# Altium project pca10156.PrjPCB (part 4 of 4)
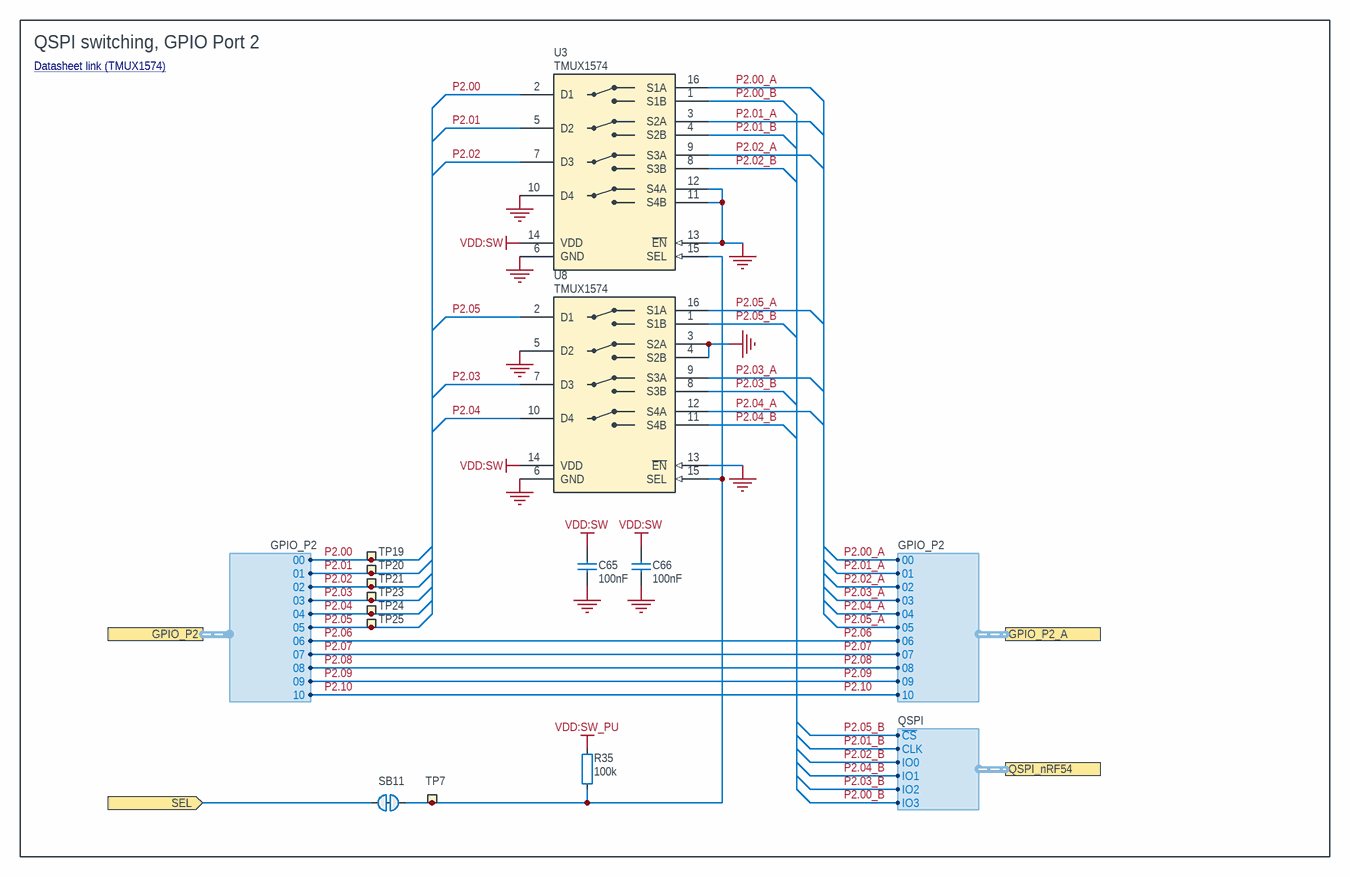
[diagram p8: pca10156_sheet8_switches.SchDoc]

## Nets that join several sheets
GND: pca10156_sheet2_nRF54L15 (23 pins), pca10156_sheet3_debugger (33 pins), pca10156_sheet4_level_shifters (22 pins), pca10156_sheet5_misc (19 pins), pca10156_sheet6_power_supply (26 pins), pca10156_sheet7_connectors (43 pins), pca10156_sheet8_switches (12 pins)
P5V0: pca10156_sheet3_debugger (R40.2), pca10156_sheet6_power_supply (13 pins), pca10156_sheet7_connectors (6 pins)
VBUS: pca10156_sheet3_debugger (J4.5 R5.2), pca10156_sheet6_power_supply (C23.2 TP8.1 U10.21), pca10156_sheet7_connectors (C54.1 R36.2 SW4.4)
VDD:DBGR: pca10156_sheet3_debugger (29 pins), pca10156_sheet4_level_shifters (10 pins), pca10156_sheet6_power_supply (C29.1 U10.12)
VDD:IO: pca10156_sheet3_debugger (R41.2), pca10156_sheet4_level_shifters (7 pins), pca10156_sheet5_misc (SB9.1), pca10156_sheet6_power_supply (R9.2 R37.2 TP11.1), pca10156_sheet7_connectors (12 pins)
VDD:nRF: pca10156_sheet2_nRF54L15 (12 pins), pca10156_sheet4_level_shifters (R28.1), pca10156_sheet5_misc (R23.2 SB10.1), pca10156_sheet6_power_supply (P6.2 R24.1 R43.1)
VDD:SW: pca10156_sheet4_level_shifters (10 pins), pca10156_sheet8_switches (C65.1 C66.1 U3.14 U8.14)
VDD:SW_PU: pca10156_sheet4_level_shifters (8 pins), pca10156_sheet8_switches (R35.2)
VDD:SWD0: pca10156_sheet4_level_shifters (C14.1 R18.2 U7.11), pca10156_sheet7_connectors (C73.2 P5.3 P19.1)
DBGR_BUTTON: pca10156_sheet1_connections (SB2.2), pca10156_sheet3_debugger (U2.AL27)
DBGR_N: pca10156_sheet3_debugger (U2.B4), pca10156_sheet7_connectors (U11.7)
DBGR_P: pca10156_sheet3_debugger (U2.B2), pca10156_sheet7_connectors (U11.6)
LED_PWR_CTRL: pca10156_sheet3_debugger (U2.A17), pca10156_sheet6_power_supply (U10.8)
NetC64_2: pca10156_sheet5_misc (5 pins), pca10156_sheet6_power_supply (U10.31)
NetJ3_A5: pca10156_sheet6_power_supply (U10.23), pca10156_sheet7_connectors (J3.A5)
NetJ3_B5: pca10156_sheet6_power_supply (U10.24), pca10156_sheet7_connectors (J3.B5)
NetP1_5: pca10156_sheet2_nRF54L15 (R33.2), pca10156_sheet7_connectors (P1.5)
NetP1_6: pca10156_sheet2_nRF54L15 (R34.2), pca10156_sheet7_connectors (P1.6)
NetSB1_2: pca10156_sheet1_connections (SB1.2 SB2.1), pca10156_sheet5_misc (SB8.1 SW1.2)
NFC1: pca10156_sheet5_misc (C17.1 R21.2), pca10156_sheet7_connectors (J7.2)
NFC2: pca10156_sheet5_misc (C19.2 R22.2), pca10156_sheet7_connectors (J7.4)
nRF54_RESET: pca10156_sheet1_connections (SB1.1), pca10156_sheet2_nRF54L15 (P3.1 R3.2), pca10156_sheet4_level_shifters (U6.9), pca10156_sheet7_connectors (P15.10 P16.10)
P0.00: pca10156_sheet2_nRF54L15 (U1.23), pca10156_sheet4_level_shifters (U4.6), pca10156_sheet7_connectors (P0.3)
P0.01: pca10156_sheet2_nRF54L15 (U1.24), pca10156_sheet4_level_shifters (U4.3), pca10156_sheet7_connectors (P0.4)
P0.02: pca10156_sheet2_nRF54L15 (U1.27), pca10156_sheet4_level_shifters (U4.13), pca10156_sheet7_connectors (P0.5)
P0.03: pca10156_sheet2_nRF54L15 (U1.28), pca10156_sheet4_level_shifters (U4.9), pca10156_sheet7_connectors (P0.6)
P0.04: pca10156_sheet2_nRF54L15 (U1.29), pca10156_sheet5_misc (SW6.2), pca10156_sheet7_connectors (P0.7)
P1.00: pca10156_sheet2_nRF54L15 (SB5.2), pca10156_sheet7_connectors (P1.3)
P1.01: pca10156_sheet2_nRF54L15 (SB6.2), pca10156_sheet7_connectors (P1.4)
P1.02/NFC1: pca10156_sheet2_nRF54L15 (R33.1 U1.3), pca10156_sheet5_misc (R21.1)
P1.03/NFC2: pca10156_sheet2_nRF54L15 (R34.1 U1.4), pca10156_sheet5_misc (R22.1)
P1.04: pca10156_sheet2_nRF54L15 (U1.5), pca10156_sheet4_level_shifters (U5.6), pca10156_sheet7_connectors (P1.7)
P1.05: pca10156_sheet2_nRF54L15 (U1.6), pca10156_sheet4_level_shifters (U5.3), pca10156_sheet7_connectors (P1.8)
P1.06: pca10156_sheet2_nRF54L15 (U1.7), pca10156_sheet4_level_shifters (U5.13), pca10156_sheet7_connectors (P1.9)
P1.07: pca10156_sheet2_nRF54L15 (U1.8), pca10156_sheet4_level_shifters (U5.9), pca10156_sheet7_connectors (P1.10)
P1.08: pca10156_sheet2_nRF54L15 (C41.2 U1.9), pca10156_sheet5_misc (SW5.2), pca10156_sheet7_connectors (P1.11)
P1.09: pca10156_sheet2_nRF54L15 (U1.37), pca10156_sheet5_misc (SW3.2), pca10156_sheet7_connectors (P1.12)
P1.10: pca10156_sheet2_nRF54L15 (U1.38), pca10156_sheet5_misc (Q3.2 R11.1), pca10156_sheet7_connectors (P1.13)
P1.11: pca10156_sheet2_nRF54L15 (U1.39), pca10156_sheet7_connectors (P1.14)
P1.12: pca10156_sheet2_nRF54L15 (U1.40), pca10156_sheet7_connectors (P1.15)
P1.13: pca10156_sheet2_nRF54L15 (U1.41), pca10156_sheet5_misc (SW2.2), pca10156_sheet7_connectors (P1.16)
P1.14: pca10156_sheet2_nRF54L15 (U1.42), pca10156_sheet5_misc (Q3.5 R27.1), pca10156_sheet7_connectors (P1.17)
P2.00: pca10156_sheet2_nRF54L15 (U1.11), pca10156_sheet8_switches (TP19.1 U3.2)
P2.00_A: pca10156_sheet7_connectors (P2.3), pca10156_sheet8_switches (U3.16)
P2.00_B: pca10156_sheet5_misc (U9.7), pca10156_sheet8_switches (U3.1)
P2.01: pca10156_sheet2_nRF54L15 (U1.12), pca10156_sheet8_switches (TP20.1 U3.5)
P2.01_A: pca10156_sheet7_connectors (P2.4), pca10156_sheet8_switches (U3.3)
P2.01_B: pca10156_sheet5_misc (U9.6), pca10156_sheet8_switches (U3.4)
P2.02: pca10156_sheet2_nRF54L15 (U1.13), pca10156_sheet8_switches (TP21.1 U3.7)
P2.02_A: pca10156_sheet7_connectors (P2.5), pca10156_sheet8_switches (U3.9)
P2.02_B: pca10156_sheet5_misc (U9.5), pca10156_sheet8_switches (U3.8)
P2.03: pca10156_sheet2_nRF54L15 (U1.14), pca10156_sheet8_switches (TP23.1 U8.7)
P2.03_A: pca10156_sheet7_connectors (P2.6), pca10156_sheet8_switches (U8.9)
P2.03_B: pca10156_sheet5_misc (U9.3), pca10156_sheet8_switches (U8.8)
P2.04: pca10156_sheet2_nRF54L15 (U1.15), pca10156_sheet8_switches (TP24.1 U8.10)
P2.04_A: pca10156_sheet7_connectors (P2.7), pca10156_sheet8_switches (U8.12)
P2.04_B: pca10156_sheet5_misc (U9.2), pca10156_sheet8_switches (U8.11)
P2.05: pca10156_sheet2_nRF54L15 (U1.16), pca10156_sheet8_switches (TP25.1 U8.2)
P2.05_A: pca10156_sheet7_connectors (P2.8), pca10156_sheet8_switches (U8.16)
P2.05_B: pca10156_sheet5_misc (R39.1 U9.1), pca10156_sheet8_switches (U8.1)
P2.06: pca10156_sheet2_nRF54L15 (U1.17), pca10156_sheet7_connectors (P2.9 P16.12)
P2.07: pca10156_sheet2_nRF54L15 (U1.18), pca10156_sheet4_level_shifters (U6.13), pca10156_sheet5_misc (Q2.5 R12.1), pca10156_sheet7_connectors (P2.10 P15.6 P16.6 P16.14)
P2.08: pca10156_sheet2_nRF54L15 (U1.19), pca10156_sheet7_connectors (P2.11 P16.16)
P2.09: pca10156_sheet2_nRF54L15 (U1.20), pca10156_sheet5_misc (Q2.2 R10.1), pca10156_sheet7_connectors (P2.12 P16.18)
P2.10: pca10156_sheet2_nRF54L15 (U1.21), pca10156_sheet7_connectors (P2.13 P16.20)
QSPI_CTRL: pca10156_sheet3_debugger (U2.B14), pca10156_sheet8_switches (SB11.1)
SWD0_CLK: pca10156_sheet3_debugger (U2.B18), pca10156_sheet4_level_shifters (U7.4)
SWD0_CLK_EXT: pca10156_sheet4_level_shifters (U7.8), pca10156_sheet7_connectors (P19.4)
SWD0_IO: pca10156_sheet3_debugger (U2.B16), pca10156_sheet4_level_shifters (U7.5)
SWD0_IO_EXT: pca10156_sheet4_level_shifters (U7.7), pca10156_sheet7_connectors (P19.2)
SWD0_RESET: pca10156_sheet3_debugger (U2.B22), pca10156_sheet4_level_shifters (U7.2)
SWD0_RESET_EXT: pca10156_sheet4_level_shifters (U7.10), pca10156_sheet7_connectors (P19.10)
SWD0_SEL: pca10156_sheet3_debugger (U2.B24), pca10156_sheet4_level_shifters (Q1.5), pca10156_sheet7_connectors (P19.3)
SWD0_SWO: pca10156_sheet3_debugger (U2.B20), pca10156_sheet4_level_shifters (U7.3)
SWD0_SWO_EXT: pca10156_sheet4_level_shifters (U7.9), pca10156_sheet7_connectors (P19.6)
SWD3_CLK: pca10156_sheet3_debugger (U2.R1), pca10156_sheet4_level_shifters (U14.3)
SWD3_CTRL: pca10156_sheet3_debugger (U2.AB2), pca10156_sheet4_level_shifters (R31.2 U6.1 U6.4 U6.11)
SWD3_IO: pca10156_sheet3_debugger (U2.N1), pca10156_sheet4_level_shifters (U14.4)
SWD3_RESET: pca10156_sheet3_debugger (U2.AA1), pca10156_sheet4_level_shifters (U14.5)
SWD3_SWO: pca10156_sheet3_debugger (U2.W1), pca10156_sheet4_level_shifters (U14.2)
SWDCLK: pca10156_sheet2_nRF54L15 (U1.26), pca10156_sheet4_level_shifters (U6.3), pca10156_sheet7_connectors (P15.4 P16.4)
SWDIO: pca10156_sheet2_nRF54L15 (U1.25), pca10156_sheet4_level_shifters (U6.6), pca10156_sheet7_connectors (P15.2 P16.2)
SWO_CTRL: pca10156_sheet3_debugger (U2.AJ1), pca10156_sheet4_level_shifters (R17.1 U6.15)
TWI0_SCL: pca10156_sheet3_debugger (U2.AF2), pca10156_sheet6_power_supply (U10.14)
TWI0_SDA: pca10156_sheet3_debugger (U2.AE1), pca10156_sheet6_power_supply (U10.13)
UART0_CTRL: pca10156_sheet3_debugger (U2.R31), pca10156_sheet4_level_shifters (R14.2 U4.1 U4.4 U12.12)
UART0_CTS: pca10156_sheet3_debugger (R32.1 U2.AL9), pca10156_sheet4_level_shifters (U12.5)
UART0_HWFC: pca10156_sheet3_debugger (U2.AK16), pca10156_sheet4_level_shifters (R13.2 U4.11 U4.15)
UART0_RTS: pca10156_sheet3_debugger (U2.AL5), pca10156_sheet4_level_shifters (U12.4)
UART0_RxD: pca10156_sheet3_debugger (U2.AL19), pca10156_sheet4_level_shifters (U12.3)
UART0_TxD: pca10156_sheet3_debugger (U2.U31), pca10156_sheet4_level_shifters (U12.2)
UART1_CTRL: pca10156_sheet3_debugger (U2.AK18), pca10156_sheet4_level_shifters (R16.2 U5.1 U5.4 U13.12)
UART1_CTS: pca10156_sheet3_debugger (R56.1 U2.AL15), pca10156_sheet4_level_shifters (U13.5)
UART1_HWFC: pca10156_sheet3_debugger (U2.AK20), pca10156_sheet4_level_shifters (R15.2 U5.11 U5.15)
UART1_RTS: pca10156_sheet3_debugger (U2.AL13), pca10156_sheet4_level_shifters (U13.4)
UART1_RxD: pca10156_sheet3_debugger (U2.AL21), pca10156_sheet4_level_shifters (U13.3)
UART1_TxD: pca10156_sheet3_debugger (U2.AL23), pca10156_sheet4_level_shifters (U13.2)

## Assembly variants
Release: not fitted C41 C56 C59 C? P3 P4 P15 P16 R24 R28 R30 R33 R34 R? R?